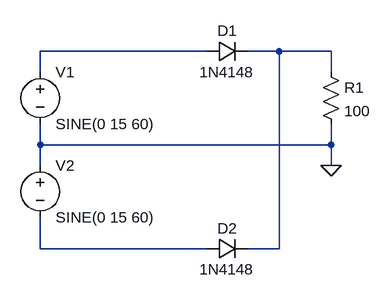
[diagram p0: schematic retificador_trafo_terminação_central.asc]
retificador_trafo_terminação_central.asc, the LTspice schematic file:
Version 4
SHEET 1 880 680
WIRE 240 -64 -16 -64
WIRE 352 -64 304 -64
WIRE 432 -64 352 -64
WIRE -16 -32 -16 -64
WIRE 432 -32 432 -64
WIRE -16 80 -16 48
WIRE 432 80 432 48
WIRE 432 80 -16 80
WIRE -16 112 -16 80
WIRE 432 112 432 80
WIRE -16 240 -16 192
WIRE 240 240 -16 240
WIRE 352 240 352 -64
WIRE 352 240 304 240
FLAG 432 112 0
SYMBOL diode 240 -48 R270
WINDOW 0 32 32 VTop 2
WINDOW 3 0 32 VBottom 2
SYMATTR InstName D1
SYMATTR Value 1N4148
SYMBOL diode 240 256 R270
WINDOW 0 32 32 VTop 2
WINDOW 3 0 32 VBottom 2
SYMATTR InstName D2
SYMATTR Value 1N4148
SYMBOL voltage -16 -48 R0
WINDOW 123 0 0 Left 0
WINDOW 39 0 0 Left 0
SYMATTR InstName V1
SYMATTR Value SINE(0 15 60)
SYMBOL voltage -16 96 R0
WINDOW 123 0 0 Left 0
WINDOW 39 0 0 Left 0
SYMATTR InstName V2
SYMATTR Value SINE(0 15 60)
SYMBOL res 416 -48 R0
SYMATTR InstName R1
SYMATTR Value 100

The netlist it stands for:
* retificador_trafo_terminação_central.asc
D1 N001 N002 1N4148
D2 N003 N002 1N4148
V1 N001 0 SINE(0 15 60)
V2 0 N003 SINE(0 15 60)
R1 N002 0 100
.model D D
.lib standard.dio
.backanno
.end